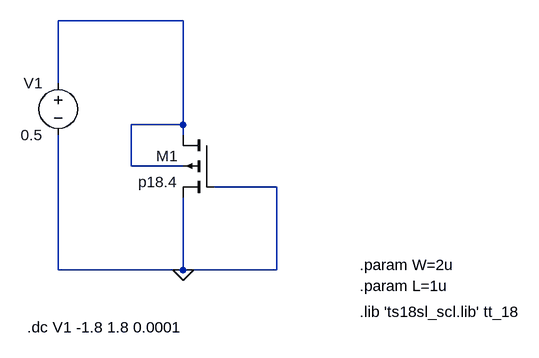
[diagram p0: schematic pseudo_resistor.asc]
pseudo_resistor.asc, the LTspice schematic file:
Version 4
SHEET 1 904 680
WIRE 352 0 160 0
WIRE 160 96 160 0
WIRE 352 160 352 0
WIRE 352 160 272 160
WIRE 352 176 352 160
WIRE 272 224 272 160
WIRE 352 224 272 224
WIRE 496 256 400 256
WIRE 160 384 160 176
WIRE 352 384 352 272
WIRE 352 384 160 384
WIRE 496 384 496 256
WIRE 496 384 352 384
FLAG 352 384 0
SYMBOL pmos4 400 176 M0
SYMATTR InstName M1
SYMATTR Value p18.4
SYMATTR Value2 l={L} w={W} ad={5*{W}*{L/2}} as={5*{W}*{L/2}} pd={5*{L} + 2*{W}} ps={5*{L} + 2*{W}}
SYMBOL voltage 160 80 M0
WINDOW 123 0 0 Left 0
WINDOW 39 0 0 Left 0
SYMATTR InstName V1
SYMATTR Value 0.5
TEXT 624 448 Left 2 !.lib 'ts18sl_scl.lib' tt_18
TEXT 112 472 Left 2 !.dc V1 -1.8 1.8 0.0001
TEXT 624 408 Left 2 !.param L=1u
TEXT 624 376 Left 2 !.param W=2u

The netlist it stands for:
* pseudo_resistor.asc
M1 N001 0 0 N001 p18.4 l={L} w={W} ad={5*{W}*{L/2}} as={5*{W}*{L/2}} pd={5*{L} + 2*{W}} ps={5*{L} + 2*{W}}
V1 N001 0 0.5
.model NMOS NMOS
.model PMOS PMOS
.lib standard.mos
.lib 'ts18sl_scl.lib' tt_18
.dc V1 -1.8 1.8 0.0001
.param L=1u
.param W=2u
.backanno
.end